# EasyEDA Pro project STM32F429BIT6 IGT6外围.epro, schematic SCH

## Sheets
1 MCU: Page Name: MCU; Project Name: 合泰杯; Schematic Name: 合泰; Update Date: 2023-08-08; Add into BOM: yes; Company: Your Company; Convert to PCB: yes; Date: 2023-06-11; Draw By: JustQin; REV: 1.0; Sheet: 1/1
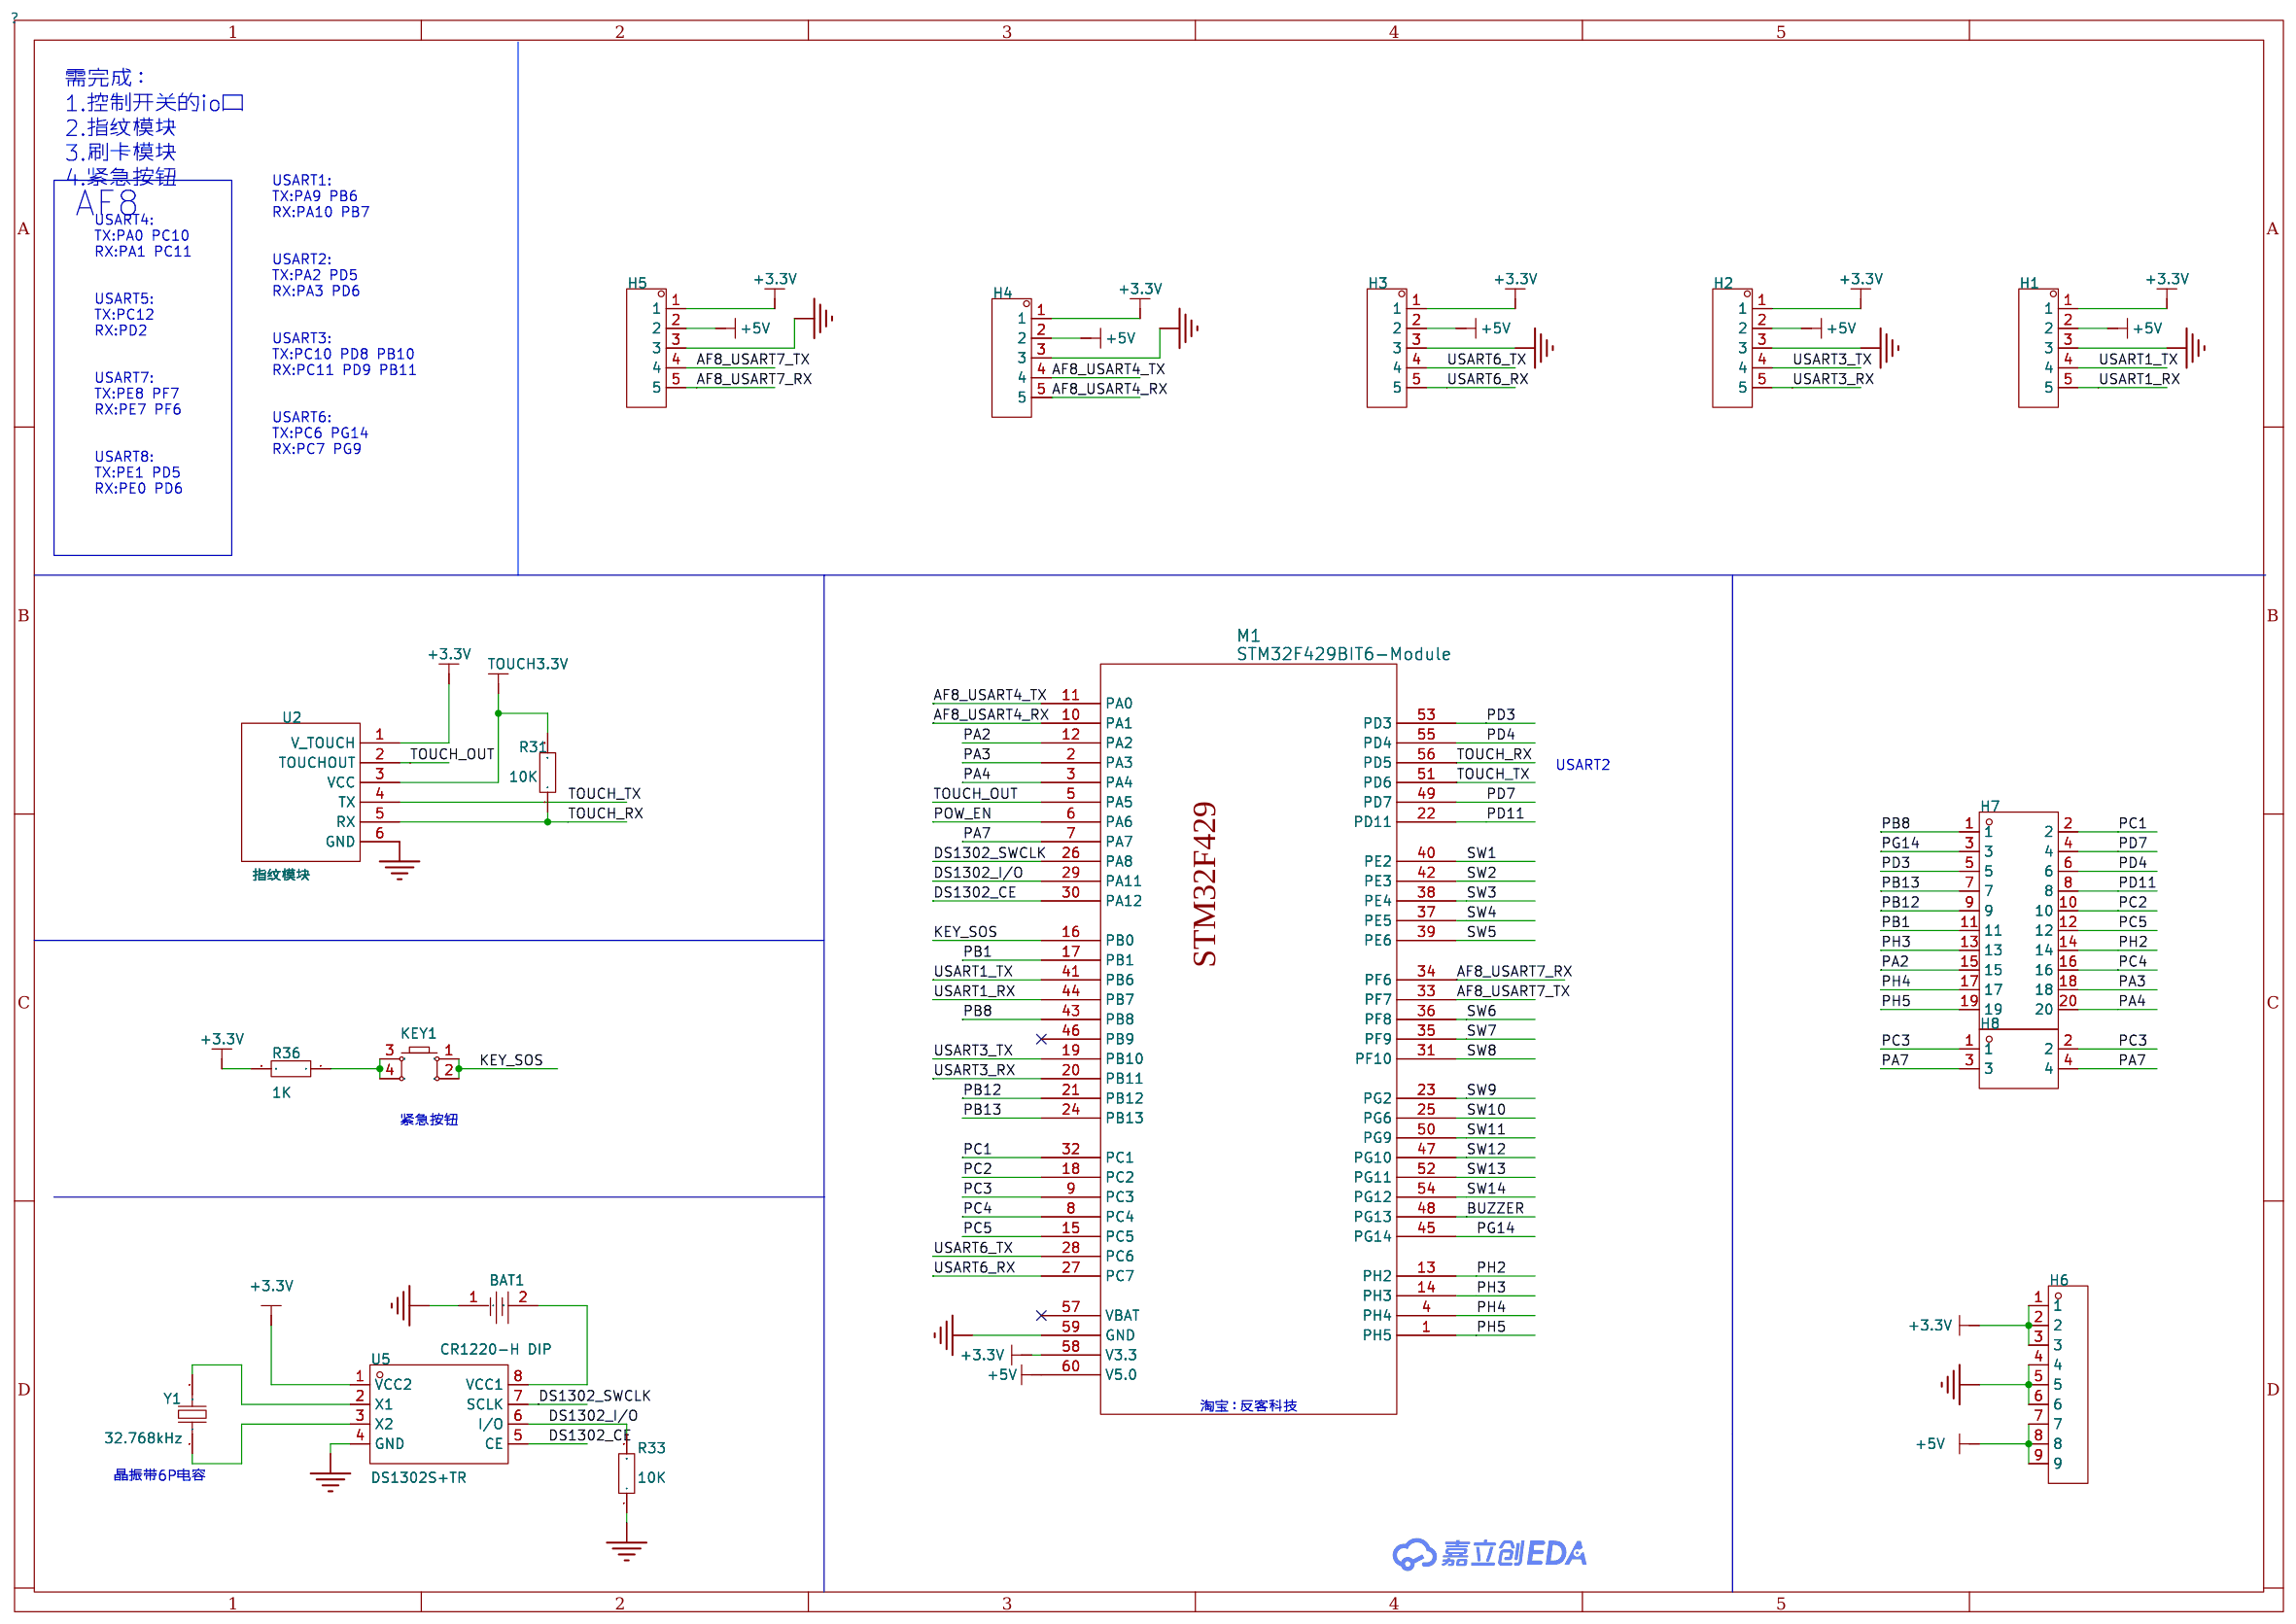
[diagram p0: MCU]
2 开关: Create Date: 2023-06-13; Page Name: 开关; Update Date: 2023-07-17; Company: 嘉立创EDA; Page Size: A4; Version: V1.0
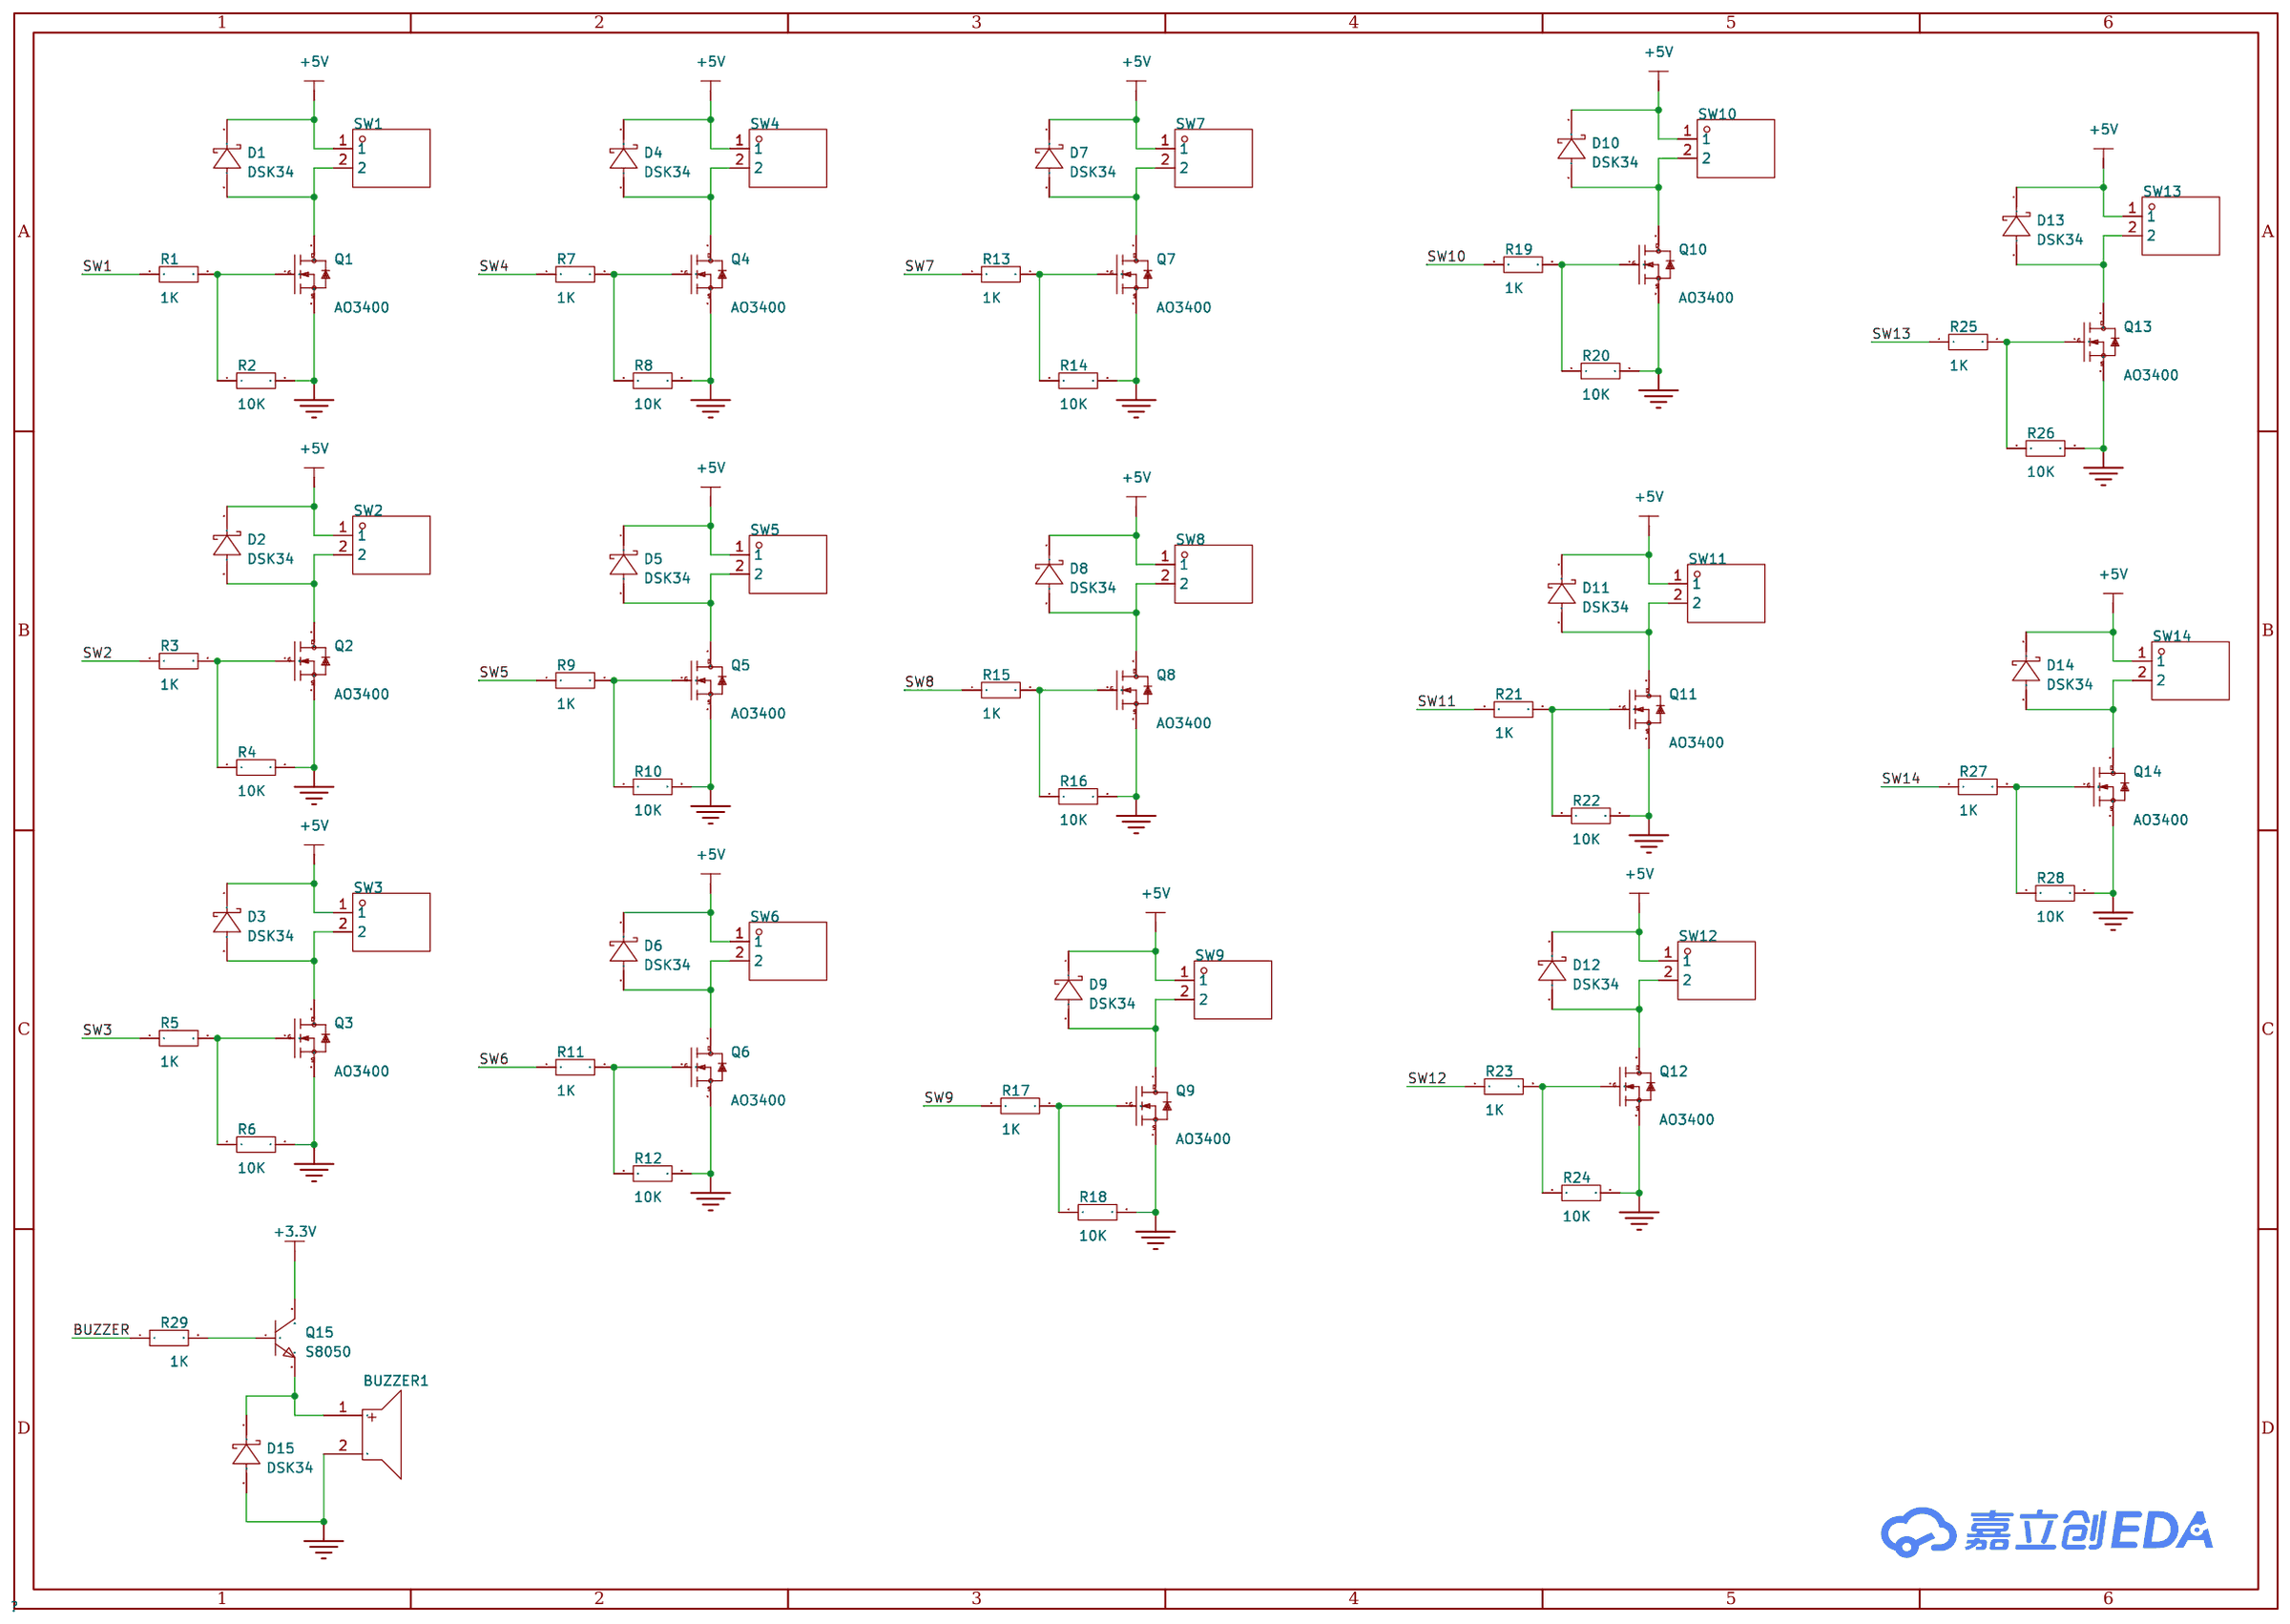
[diagram p1: 开关]
3 Power: Create Date: 2023-06-15; Page Name: Power; Company: 嘉立创EDA; Page Size: A4; Version: V1.0
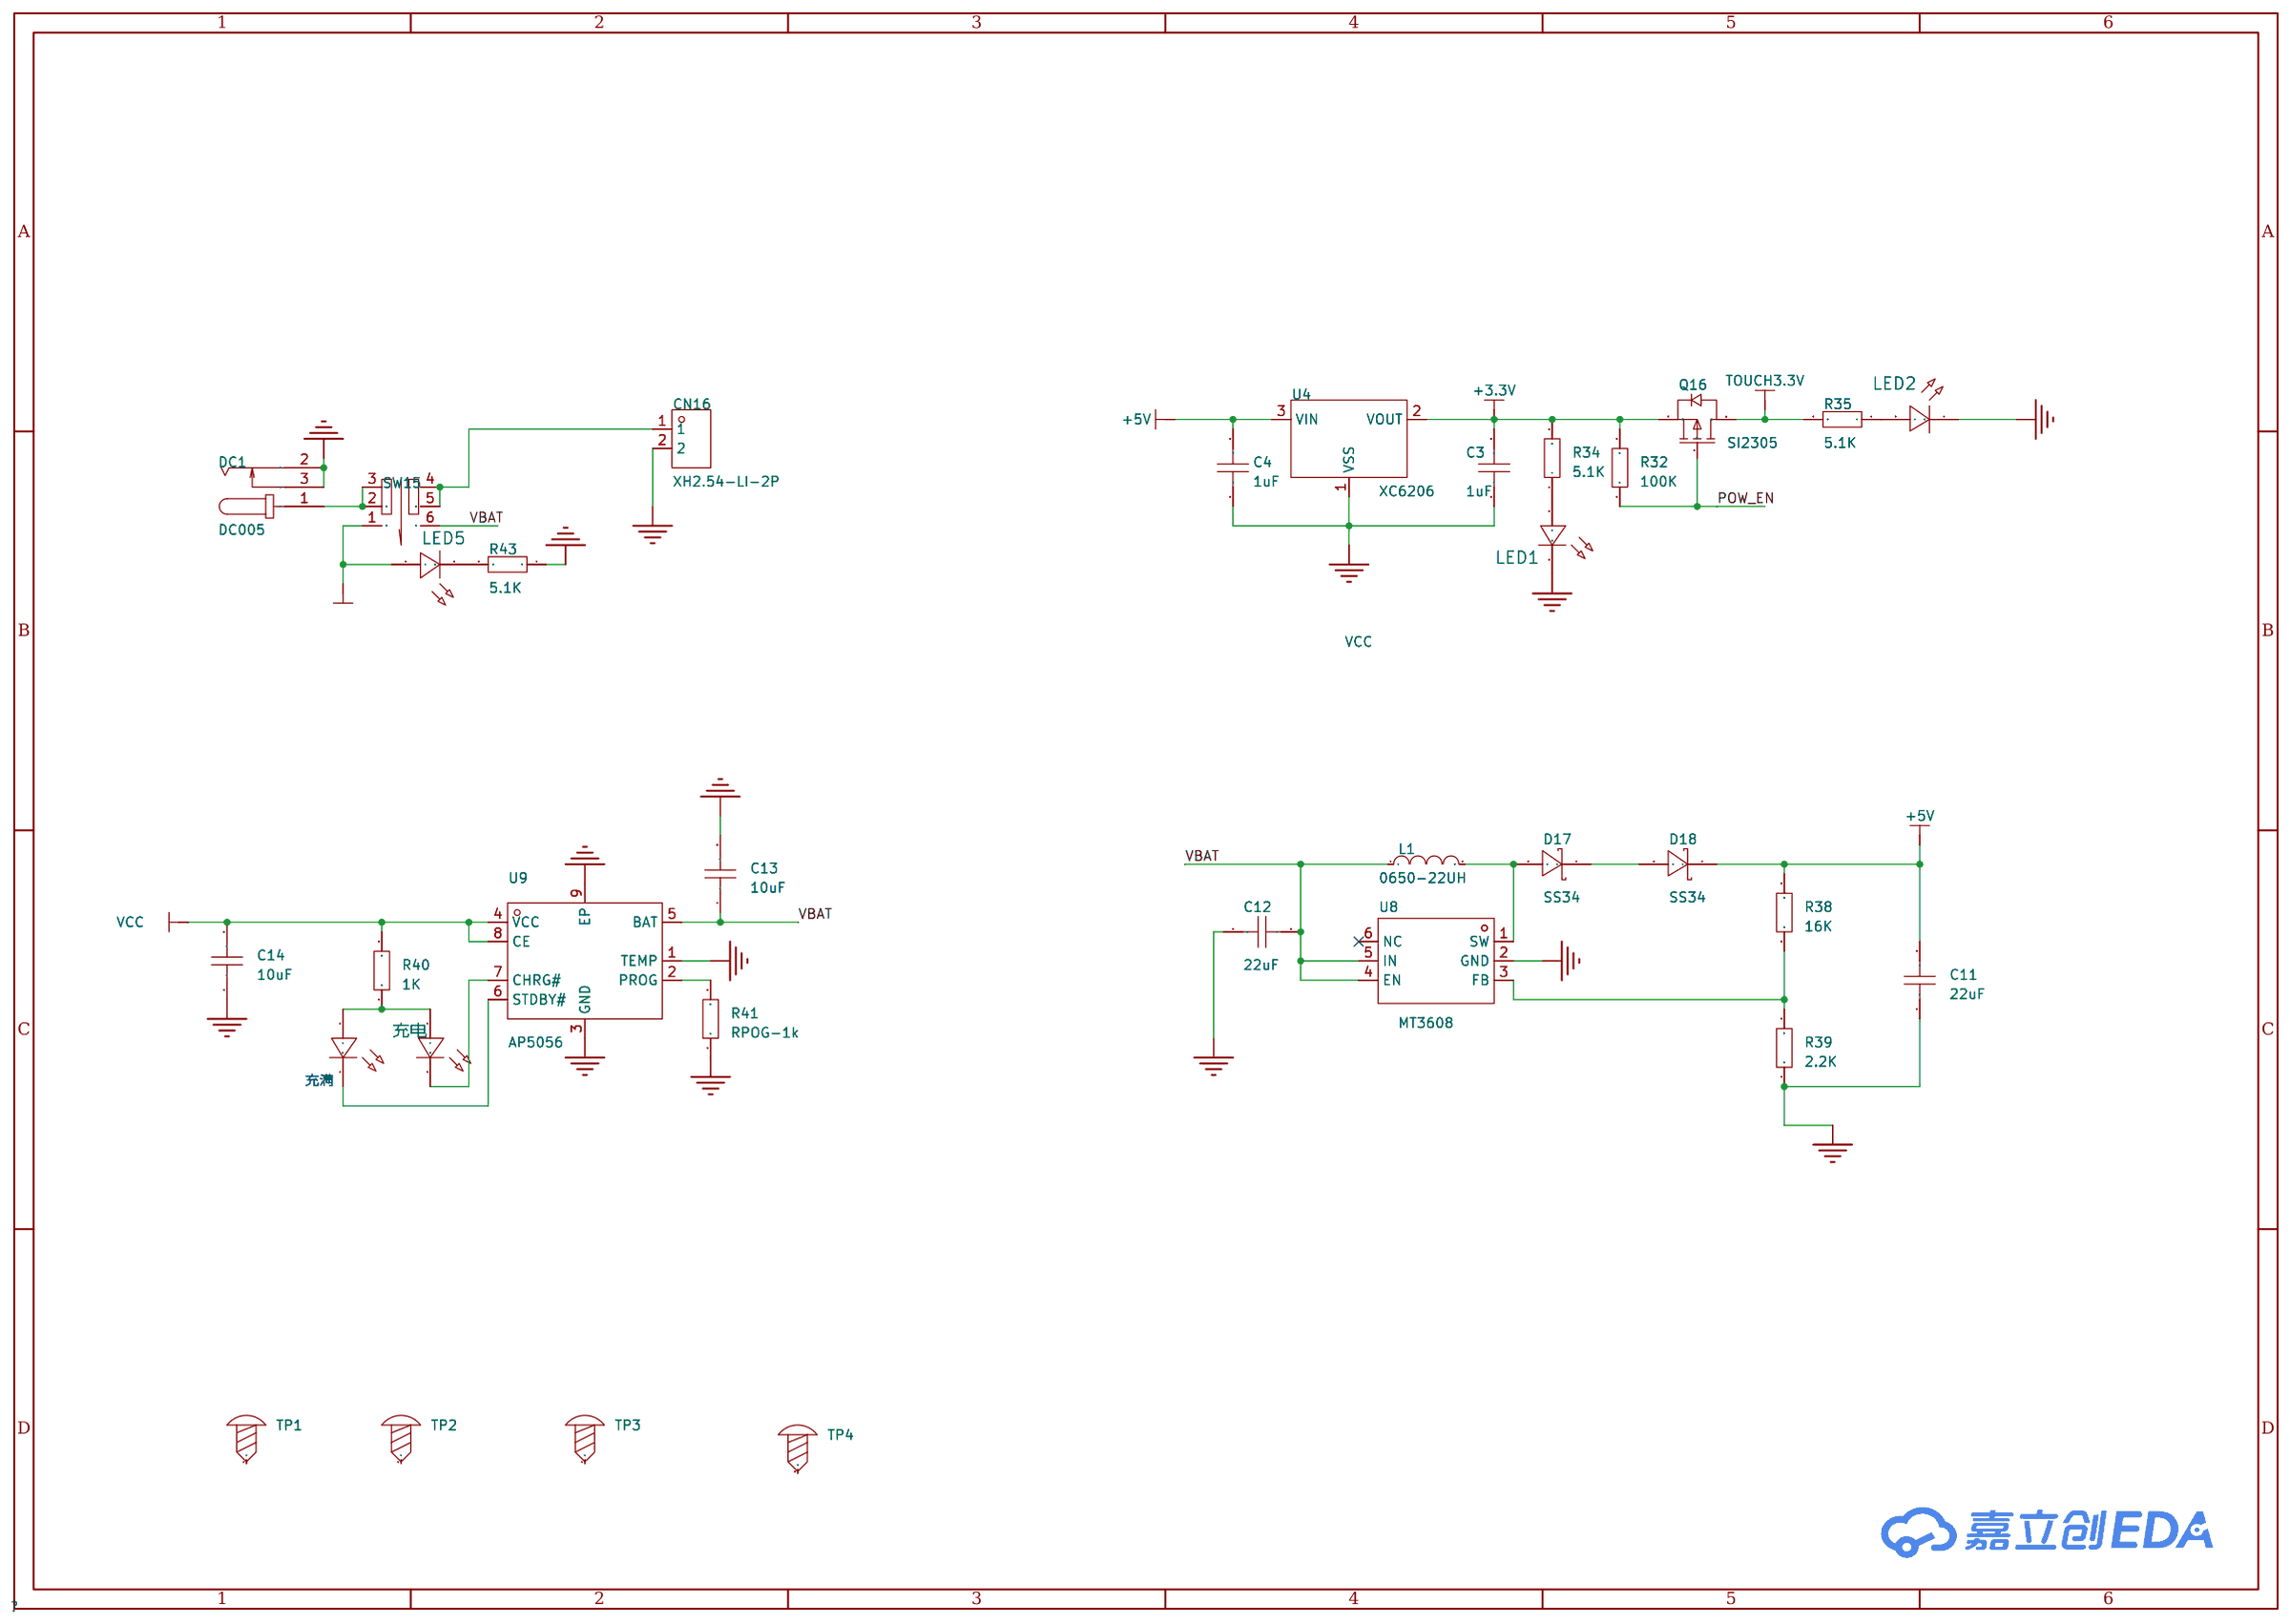
[diagram p2: Power]

## Parts
sheet MCU
BAT1  CR1220-H DIP  [BAT-TH_CR1220-H-DIP]
H1  -  [HDR-TH_5P-P2.54-V-M]
H2  -  [HDR-TH_5P-P2.54-V-M]
H3  -  [HDR-TH_5P-P2.54-V-M]
H4  -  [HDR-TH_5P-P2.54-V-M]
H5  -  [HDR-TH_5P-P2.54-V-M]
H6  -  [HDR-TH_9P-P2.54-V-M]
H7  -  [HDR-TH_20P-P2.54-V-M-R2-C10-S2.54]
H8  -  [HDR-TH_4P-P2.54-V-M-R2-C2-S2.54-1]
KEY1  -  [SW-SMD_4P-L6.0-W6.0-P4.50-LS9.0-2]
M1  STM32F429BIT6-Module  [STM32F429BI_CORE]
R31  10K  [R0603]
R33  10K  [R0603]
R36  1K  [R0603]
U2  指纹模块  [CONN-SMD_A1002WV-S-6P]
U5  DS1302S+TR  [SOP-8_L5.3-W5.3-P1.27-LS8.0-BL]
Y1  32.768kHz  [FC-135R_L3.2-W1.5]
sheet Power
C3  1uF  [C0603]
C4  1uF  [C0603]
C11  22uF  [C0603]
C12  22uF  [C0603]
C13  10uF  [C0603]
C14  10uF  [C0603]
CN16  XH2.54-LI-2P  [CONN-TH_2P-P2.54_HDR2]
D17  SS34  [DO-214AC_L4.3-W2.7-LS5.2-RD]
D18  SS34  [DO-214AC_L4.3-W2.7-LS5.2-RD]
DC1  DC005  [DC-IN-TH_DC005]
L1  0650-22UH  [IND-SMD_L7.8-W7.0_MAPM0630F]
LED1  -  [LED_0603]
LED2  -  [LED_0603]
LED5  -  [LED_0603]
Q16  SI2305  [SOT-23-3_L2.9-W1.6-P1.90-LS2.8-BR]
R32  100K  [R0603]
R34  5.1K  [R0603]
R35  5.1K  [R0603]
R38  16K  [R0603]
R39  2.2K  [R0603]
R40  1K  [R0603]
R41  RPOG-1k  [R0603]
R43  5.1K  [R0603]
SW15  自锁开关 5.8Z白灰白260G  [SW-TH_6P-L5.8-W5.8-P2.00-LS4.5-TR]
TP1  -  [M4螺丝]
TP2  -  [M4螺丝]
TP3  -  [M4螺丝]
TP4  -  [M4螺丝]
U4  XC6206  [SOT-23-3_L2.9-W1.3-P1.90-LS2.4-BR]
U8  MT3608  [SOT-23-6_L2.9-W1.6-P0.95-LS2.8-BL]
U9  AP5056  [SOP-8_L4.9-W3.9-P1.27-LS6.0-BL-EP]
充满  -  [LED_0603]
充电  -  [LED_0603]
sheet 开关
BUZZER1  2800Hz  [BUZ-TH_BD9.0-P5.00-D0.6-FD]
D1  DSK34  [SOD-123FL_L2.7-W1.8-LS3.8-RD]
D2  DSK34  [SOD-123FL_L2.7-W1.8-LS3.8-RD]
D3  DSK34  [SOD-123FL_L2.7-W1.8-LS3.8-RD]
D4  DSK34  [SOD-123FL_L2.7-W1.8-LS3.8-RD]
D5  DSK34  [SOD-123FL_L2.7-W1.8-LS3.8-RD]
D6  DSK34  [SOD-123FL_L2.7-W1.8-LS3.8-RD]
D7  DSK34  [SOD-123FL_L2.7-W1.8-LS3.8-RD]
D8  DSK34  [SOD-123FL_L2.7-W1.8-LS3.8-RD]
D9  DSK34  [SOD-123FL_L2.7-W1.8-LS3.8-RD]
D10  DSK34  [SOD-123FL_L2.7-W1.8-LS3.8-RD]
D11  DSK34  [SOD-123FL_L2.7-W1.8-LS3.8-RD]
D12  DSK34  [SOD-123FL_L2.7-W1.8-LS3.8-RD]
D13  DSK34  [SOD-123FL_L2.7-W1.8-LS3.8-RD]
D14  DSK34  [SOD-123FL_L2.7-W1.8-LS3.8-RD]
D15  DSK34  [SOD-123FL_L2.7-W1.8-LS3.8-RD]
Q1  AO3400  [SOT-23-3_L2.9-W1.3-P1.90-LS2.4-BR]
Q2  AO3400  [SOT-23-3_L2.9-W1.3-P1.90-LS2.4-BR]
Q3  AO3400  [SOT-23-3_L2.9-W1.3-P1.90-LS2.4-BR]
Q4  AO3400  [SOT-23-3_L2.9-W1.3-P1.90-LS2.4-BR]
Q5  AO3400  [SOT-23-3_L2.9-W1.3-P1.90-LS2.4-BR]
Q6  AO3400  [SOT-23-3_L2.9-W1.3-P1.90-LS2.4-BR]
Q7  AO3400  [SOT-23-3_L2.9-W1.3-P1.90-LS2.4-BR]
Q8  AO3400  [SOT-23-3_L2.9-W1.3-P1.90-LS2.4-BR]
Q9  AO3400  [SOT-23-3_L2.9-W1.3-P1.90-LS2.4-BR]
Q10  AO3400  [SOT-23-3_L2.9-W1.3-P1.90-LS2.4-BR]
Q11  AO3400  [SOT-23-3_L2.9-W1.3-P1.90-LS2.4-BR]
Q12  AO3400  [SOT-23-3_L2.9-W1.3-P1.90-LS2.4-BR]
Q13  AO3400  [SOT-23-3_L2.9-W1.3-P1.90-LS2.4-BR]
Q14  AO3400  [SOT-23-3_L2.9-W1.3-P1.90-LS2.4-BR]
Q15  S8050  [SOT-23-3_L2.9-W1.6-P1.90-LS2.8-BR]
R1  1K  [R0603]
R2  10K  [R0603]
R3  1K  [R0603]
R4  10K  [R0603]
R5  1K  [R0603]
R6  10K  [R0603]
R7  1K  [R0603]
R8  10K  [R0603]
R9  1K  [R0603]
R10  10K  [R0603]
R11  1K  [R0603]
R12  10K  [R0603]
R13  1K  [R0603]
R14  10K  [R0603]
R15  1K  [R0603]
R16  10K  [R0603]
R17  1K  [R0603]
R18  10K  [R0603]
R19  1K  [R0603]
R20  10K  [R0603]
R21  1K  [R0603]
R22  10K  [R0603]
R23  1K  [R0603]
R24  10K  [R0603]
R25  1K  [R0603]
R26  10K  [R0603]
R27  1K  [R0603]
R28  10K  [R0603]
R29  1K  [R0603]
SW1  B2B-XH-A(LF)(SN)  [CONN-TH_B2B-XH-A-LF-SN]
SW2  B2B-XH-A(LF)(SN)  [CONN-TH_B2B-XH-A-LF-SN]
SW3  B2B-XH-A(LF)(SN)  [CONN-TH_B2B-XH-A-LF-SN]
SW4  B2B-XH-A(LF)(SN)  [CONN-TH_B2B-XH-A-LF-SN]
SW5  B2B-XH-A(LF)(SN)  [CONN-TH_B2B-XH-A-LF-SN]
SW6  B2B-XH-A(LF)(SN)  [CONN-TH_B2B-XH-A-LF-SN]
SW7  B2B-XH-A(LF)(SN)  [CONN-TH_B2B-XH-A-LF-SN]
SW8  B2B-XH-A(LF)(SN)  [CONN-TH_B2B-XH-A-LF-SN]
SW9  B2B-XH-A(LF)(SN)  [CONN-TH_B2B-XH-A-LF-SN]
SW10  B2B-XH-A(LF)(SN)  [CONN-TH_B2B-XH-A-LF-SN]
SW11  B2B-XH-A(LF)(SN)  [CONN-TH_B2B-XH-A-LF-SN]
SW12  B2B-XH-A(LF)(SN)  [CONN-TH_B2B-XH-A-LF-SN]
SW13  B2B-XH-A(LF)(SN)  [CONN-TH_B2B-XH-A-LF-SN]
SW14  B2B-XH-A(LF)(SN)  [CONN-TH_B2B-XH-A-LF-SN]

## Library data of the parts
BAT1 = CR1220-H DIP: 插件,φ12.6x2.2mm; LCSC Part Name: FLYOUNG(远阳) 纽扣电池CR1220 3V 卧式焊脚 CR1220-H DIP; Supplier Part: C5154873; Manufacturer: FLYOUNG(远阳); JLCPCB Part Class: Extended Part; Datasheet: https://atta.szlcsc.com/upload/public/pdf/source/20230316/B36AFCD2634B313A32389D3C0D8C701B.pdf; Supplier: LCSC
H1-H5 = HDR-M_2.54_1x5P: Supplier Part: C358687; Supplier Footprint: 插件
H6 = HDR-M_2.54-1x9P: Supplier Part: C492408; Supplier Footprint: 插件
H7 = HDR-M_2.54_2x10: Supplier Part: C30734; Supplier Footprint: 插件,P=2.54mm
H8 = HDR-M_2.54_2x2: Supplier Part: C160338; Supplier Footprint: 插件,P=2.54mm
KEY1 = Key_SMD_6x6x6.5: Supplier Footprint: SMD
M1 = STM32F429BIT6-Module
R1-R29 R31-R36 R38-R41 R43 = Res_0603: Supplier Footprint: 0603
U2 = HLK-FPM383C: JLCPCB Part Class: 扩展库
U5 = DS1302S+T&R: Supplier Part: C880673; Manufacturer: MAXIM(美信); Supplier Footprint: SO-8; JLCPCB Part Class: Extended Part; Datasheet: https://atta.szlcsc.com/upload/public/pdf/source/20201223/C880673_7692D9A17A3D1BB2F2A52002F2E3DE01.pdf; Supplier: LCSC
Y1 = Q13FC1350000400: 频率:32.768kHz;频率公差:±20ppm;负载电容:12.5pF;; LCSC Part Name: 32.768kHz ±20ppm 12.5pF; Supplier Part: C32346; Manufacturer: EPSON(爱普生); Supplier Footprint: SMD3215-2P; JLCPCB Part Class: Basic Part; Datasheet: https://atta.szlcsc.com/upload/public/pdf/source/20190108/C32346_746D6B07EAF90824457A96480007685F.pdf; Supplier: LCSC; Crystal Type: 贴片无源晶振; Frequency Tolerance: ±20ppm; Load Capacitance: 12.5pF; Equivalent Series Resistance (ESR): 70kΩ; Operating Temperature: -40℃~+85℃
C3 C4 C11-C14 = CAP_0603: Supplier Footprint: 0603
CN16 = XH2.54-LI-2P: Supplier Part: C9900023170; Supplier Footprint: CONN-TH_2[; JLCPCB Part Class: Extended Part; Supplier: LCSC
D17 D18 = SS34_C8678: 二极管配置:独立式;直流反向耐压(Vr):40V;平均整流电流(Io):3A;正向压降(Vf):550mV@3A;; LCSC Part Name: 40V 3A 550mV@3A; Supplier Part: C8678; Manufacturer: MDD; Supplier Footprint: SMA(DO-214AC); JLCPCB Part Class: Basic Part; Datasheet: https://atta.szlcsc.com/upload/public/pdf/source/20230314/A80AE34493C69B89E2F4B1712F433538.pdf; Supplier: LCSC; Diode Configuration: 独立式; Reverse Voltage (Vr): 40V; Average Rectified Current (Io): 3A; Forward Voltage (Vf@If): 550mV@3A; Reverse Leakage Current (Ir): 500uA@40V
DC1 = DC005: 连接器类型:DC电源插座;安装方式:弯插;触点内径:2mm;触点外径:6.3mm;额定电流:500mA;额定电压:30V;工作温度范围:-40℃~+55℃;; LCSC Part Name: DC电源插座 内径:2mm 外径:6.3mm 铁材质; Supplier Part: C431533; Manufacturer: SHOU HAN(首韩); Supplier Footprint: 插件; JLCPCB Part Class: Extended Part; Datasheet: https://atta.szlcsc.com/upload/public/pdf/source/20190925/C431533_4751811035784AC1D38EBC85F7905E99.pdf; Supplier: LCSC; Connector Type: DC电源插座; Mounting Style: 弯插; Inside Contact Diameter: 2mm; Outside Contact Diameter: 6.3mm; Current Rating (Max): 500mA; Voltage Rating (Max): 30V; Operating Temperature Range: -40℃~+55℃
L1 = 0650-2.2UH: Supplier Part: C9900012394; Supplier Footprint: SMD_0650; JLCPCB Part Class: Extended Part; Datasheet: https://atta.szlcsc.comnull; Supplier: LCSC
LED1 LED2 LED5 充电 = LED_0603-R: Supplier Footprint: 0603
Q16 = SI2305_C382302: 类型:P沟道;漏源电压(Vdss):20V;连续漏极电流(Id):4.2A;功率(Pd):1.38W;导通电阻(RDS(on)@Vgs,Id):65mΩ@4.5V,4.2A;阈值电压(Vgs(th)@Id):500mV@250uA;; LCSC Part Name: P沟道 20V 4.2A; Supplier Part: C382302; Manufacturer: KEXIN(科信); Supplier Footprint: SOT-23; JLCPCB Part Class: Extended Part; Datasheet: https://atta.szlcsc.com/upload/public/pdf/source/20190710/C382302_C5AD358ABF6A9CE4DBEEB24A63E5B0AD.pdf; Supplier: LCSC; Type: P沟道; Drain Source Voltage (Vdss): 20V; Continuous Drain Current (Id): 4.2A; Power Dissipation (Pd): 1.38W; Drain Source On Resistance (RDS(on)@Vgs,Id): 65mΩ@4.5V,4.2A; Gate Threshold Voltage (Vgs(th)@Id): 500mV@250uA
SW15 = 自锁开关 5.8Z白灰白260G: 耐温260度; LCSC Part Name: 自锁开关 5.8Z白灰白 260G  5.8*5.8mm; Supplier Part: C56857; Supplier Footprint: Through Hole; JLCPCB Part Class: Extended Part; Datasheet: https://atta.szlcsc.com/upload/public/pdf/source/20160318/1458266987096.pdf; Supplier: LCSC
TP1-TP4 = M4螺丝: Supplier Footprint: 插件
U4 = XC6206P332MR_C5148692: 输出类型:固定;输出极性:正;最大输入电压:8V;输出电压:3.3V;输出电流:300mA;; LCSC Part Name: XC6206P332MR; Supplier Part: C5148692; Manufacturer: HXY MOSFET(华轩阳电子); Supplier Footprint: SOT-23; JLCPCB Part Class: Extended Part; Datasheet: https://atta.szlcsc.com/upload/public/pdf/source/20230315/7D5B35EFFBBF81C2EFC36318D2A1A670.pdf; Supplier: LCSC; Output Type: 固定; Output Polarity: 正; Number of Outputs: 1; Maximum Input Voltage: 8V; Output Voltage: 3.3V; Dropout Voltage: 240mV@(50mA); Output Current: 300mA
U8 = MT3608: 功能类型:升压型;输入电压:2V~24V;输出电压:28V;输出电流(最大值):-;; LCSC Part Name: 升压型 输入2V~24V 输出28V; Supplier Part: C84817; Manufacturer: 西安航天民芯; Supplier Footprint: SOT-23-6; JLCPCB Part Class: Extended Part; Datasheet: https://atta.szlcsc.com/upload/public/pdf/source/20161110/1478743351706.pdf; Supplier: LCSC; Function: 升压型; Number of Outputs: 1; Topology: 升压式; Input Voltage: 2V~24V; Output Voltage: 28V; Switching Frequency: 1.2MHz
U9 = AP5056: 常用锂电池充电芯片，功能同TP4056; Supplier Part: C81910; Manufacturer: chipown(芯朋微电子); Supplier Footprint: SOP-8-EP; JLCPCB Part Class: Extended Part; Datasheet: https://atta.szlcsc.com/upload/public/pdf/source/20170918/C81910_1505700200349975039.pdf; Supplier: LCSC
充满 = LED_0603-G: Supplier Footprint: 0603
BUZZER1 = YX-YT9042 3v: 驱动方式:有源(内含驱动线路);构造类型:电磁式;额定电压:3V;工作电压:2V~4V;消耗电流:30mA;频率:2800Hz;声压(SPL):80dB@10cm;直径(φD):9mm;长度:-;宽度:-;高度:4.2mm;工作温度:-20℃~+70℃;; LCSC Part Name: 有源电磁式蜂鸣器; Supplier Part: C781847; Manufacturer: YUEXIN(悦馨); Supplier Footprint: 插件; JLCPCB Part Class: Extended Part; Datasheet: https://atta.szlcsc.com/upload/public/pdf/source/20200925/C781847_A50BA0C189E3E52F6E474989C5FCC3AC.pdf; Supplier: LCSC; Oscillator Circuit: 有源(内含驱动线路); Technology Type: 电磁式; Rated Voltage: 3V; Operating Voltage: 2V~4V; Current Consumption: 30mA; Sound Pressure Level (SPL): 80dB@10cm; Diameter (φD): 9mm; Height: 4.2mm; Operating Temperature: -20℃~+70℃
D1-D15 = DSK34_C727076: Supplier Part: C727076; Manufacturer: TWGMC(台湾迪嘉); Supplier Footprint: SOD-123FL; JLCPCB Part Class: Extended Part; Datasheet: https://atta.szlcsc.com/upload/public/pdf/source/20200828/C727076_B37FCA1E25E95F22A97D5A5D18D72E25.pdf; Supplier: LCSC
Q1-Q14 = AO3400_C181090: 类型:N沟道;漏源电压(Vdss):30V;连续漏极电流(Id):5.8A;功率(Pd):350mW;导通电阻(RDS(on)@Vgs,Id):35mΩ@10V,5.8A;阈值电压(Vgs(th)@Id):1.4V@250uA;; LCSC Part Name: N沟道 30V 5.8A; Supplier Part: C181090; Manufacturer: Hottech(合科泰); Supplier Footprint: SOT-23; JLCPCB Part Class: Extended Part; Datasheet: https://atta.szlcsc.com/upload/public/pdf/source/20220427/6A3871894567E8883DB64081D5FF8011.pdf; Supplier: LCSC; Type: N沟道; Drain Source Voltage (Vdss): 30V; Continuous Drain Current (Id): 5.8A; Power Dissipation (Pd): 350mW; Drain Source On Resistance (RDS(on)@Vgs,Id): 35mΩ@10V,5.8A; Gate Threshold Voltage (Vgs(th)@Id): 1.4V@250uA
Q15 = S8050_C105433: 晶体管类型:NPN;集射极击穿电压(Vceo):25V;集电极电流(Ic):500mA;功率(Pd):300mW;直流电流增益(hFE@Ic,Vce):120@50mA,1V;; LCSC Part Name: NPN 25V 500mA L档 120-200; Supplier Part: C105433; Manufacturer: CJ(江苏长电/长晶); Supplier Footprint: SOT-23; JLCPCB Part Class: Extended Part; Datasheet: https://atta.szlcsc.com/upload/public/pdf/source/20170415/1492237762328.pdf; Supplier: LCSC; Transistor Type: NPN; Collector-Emitter Breakdown Voltage (Vceo): 25V; Collector Current (Ic): 500mA; Power Dissipation (Pd): 300mW; Collector Cut-Off Current (Icbo): 100nA; Collector-Emitter Saturation Voltage (VCE(sat)@Ic,Ib): 600mV@500mA,50mA; DC Current Gain (hFE@Ic,Vce): 120@50mA,1V; Transition Frequency (fT): 150MHz; Operating Temperature: +150℃@(Tj)
SW1-SW14 = B2B-XH-A(LF)(SN): 参考系列:XH;间距:2.5mm;插针结构:1x2P;排数:1;每排PIN数:2;行距:-;安装方式:-;触头材质:黄铜;; LCSC Part Name: XH 2.5mm 1x2P; Supplier Part: C158012; Manufacturer: JST; Supplier Footprint: 插件,P=2.5mm; JLCPCB Part Class: Extended Part; Datasheet: https://atta.szlcsc.com/upload/public/pdf/source/20180319/9D0AC2122F92891443E3C996983D6D0E.pdf; Supplier: LCSC; Reference Series: XH; Pitch: 2.5mm; Pins Structure: 1x2P; Number of Rows: 1; Number of PINs Per Row: 2; Contact Material: 黄铜

## Nets
+3.3V: C3.2 H1.1 H2.1 H3.1 H4.1 H5.1 H6.1 H6.2 H6.3 M1.58(V3.3) Q15.3 Q16.2(S) R32.2 R34.2 R36.2 U2.1(V_TOUCH) U4.2(VOUT) U5.1(VCC2)
+5V: C4.2 C11.2 D1.1(K) D2.1(K) D3.1(K) D4.1(K) D5.1(K) D6.1(K) D7.1(K) D8.1(K) D9.1(K) D10.1(K) D11.1(K) D12.1(K) D13.1(K) D14.1(K) D18.1(K) H1.2 H2.2 H3.2 H4.2 H5.2 H6.7 H6.8 H6.9 M1.60(V5.0) R38.2 SW1.1 SW2.1 SW3.1 SW4.1 SW5.1 SW6.1 SW7.1 SW8.1 SW9.1 SW10.1 SW11.1 SW12.1 SW13.1 SW14.1 U4.3(VIN)
GND: BAT1.1 BUZZER1.2 C3.1 C4.1 C11.1 C12.2 C13.2 C14.1 CN16.2 D15.2(A) DC1.2 DC1.3 H1.3 H2.3 H3.3 H4.3 H5.3 H6.4 H6.5 H6.6 LED1.1(C) LED2.1(C) M1.59(GND) Q1.2(S) Q2.2(S) Q3.2(S) Q4.2(S) Q5.2(S) Q6.2(S) Q7.2(S) Q8.2(S) Q9.2(S) Q10.2(S) Q11.2(S) Q12.2(S) Q13.2(S) Q14.2(S) R2.2 R4.2 R6.2 R8.2 R10.2 R12.2 R14.2 R16.2 R18.2 R20.2 R22.2 R24.2 R26.2 R28.2 R33.1 R39.1 R41.1 R43.1 U2.6(GND) U4.1(VSS) U5.4(GND) U8.2(GND) U9.1(TEMP) U9.3(GND) U9.9(EP)
VBAT: C12.1 C13.1 L1.1 SW15.6 U8.4(EN) U8.5(IN) U9.5(BAT)
VCC: C14.2 LED5.2(A) R40.2 SW15.1 U9.4(VCC) U9.8(CE)
AF8_USART4_RX: H4.5 M1.10(PA1)
AF8_USART4_TX: H4.4 M1.11(PA0)
AF8_USART7_RX: H5.5 M1.34(PF6)
AF8_USART7_TX: H5.4 M1.33(PF7)
BUZZER: M1.48(PG13) R29.1
DS1302_CE: M1.30(PA12) U5.5(CE)
DS1302_I/O: M1.29(PA11) R33.2 U5.6(I/O)
DS1302_SWCLK: M1.26(PA8) U5.7(SCLK)
KEY_SOS: KEY1.1 KEY1.2 M1.16(PB0)
PA2: H7.15 M1.12(PA2)
PA3: H7.18 M1.2(PA3)
PA4: H7.20 M1.3(PA4)
PA7: H8.3 H8.4 M1.7(PA7)
PB1: H7.11 M1.17(PB1)
PB8: H7.1 M1.43(PB8)
PB12: H7.9 M1.21(PB12)
PB13: H7.7 M1.24(PB13)
PC1: H7.2 M1.32(PC1)
PC2: H7.10 M1.18(PC2)
PC3: H8.1 H8.2 M1.9(PC3)
PC4: H7.16 M1.8(PC4)
PC5: H7.12 M1.15(PC5)
PD3: H7.5 M1.53(PD3)
PD4: H7.6 M1.55(PD4)
PD7: H7.4 M1.49(PD7)
PD11: H7.8 M1.22(PD11)
PG14: H7.3 M1.45(PG14)
PH2: H7.14 M1.13(PH2)
PH3: H7.13 M1.14(PH3)
PH4: H7.17 M1.4(PH4)
PH5: H7.19 M1.1(PH5)
POW_EN: M1.6(PA6) Q16.1(G) R32.1
SW1: M1.40(PE2) R1.1
SW2: M1.42(PE3) R3.1
SW3: M1.38(PE4) R5.1
SW4: M1.37(PE5) R7.1
SW5: M1.39(PE6) R9.1
SW6: M1.36(PF8) R11.1
SW7: M1.35(PF9) R13.1
SW8: M1.31(PF10) R15.1
SW9: M1.23(PG2) R17.1
SW10: M1.25(PG6) R19.1
SW11: M1.50(PG9) R21.1
SW12: M1.47(PG10) R23.1
SW13: M1.52(PG11) R25.1
SW14: M1.54(PG12) R27.1
TOUCH3.3V: Q16.3(D) R31.2 R35.2 U2.3(VCC)
TOUCH_OUT: M1.5(PA5) U2.2(TOUCHOUT)
TOUCH_RX: M1.56(PD5) R31.1 U2.5(RX)
TOUCH_TX: M1.51(PD6) U2.4(TX)
USART1_RX: H1.5 M1.44(PB7)
USART1_TX: H1.4 M1.41(PB6)
USART3_RX: H2.5 M1.20(PB11)
USART3_TX: H2.4 M1.19(PB10)
USART6_RX: H3.5 M1.27(PC7)
USART6_TX: H3.4 M1.28(PC6)
$1N5077: BAT1.2 U5.8(VCC1)
$1N5205: U5.3(X2) Y1.1
$1N8903: KEY1.3 KEY1.4 R36.1
$1N11477: U5.2(X1) Y1.2
$2N2294: D1.2(A) Q1.3(D) SW1.2
$2N2302: Q1.1(G) R1.2 R2.1
$2N2313: D2.2(A) Q2.3(D) SW2.2
$2N2321: Q2.1(G) R3.2 R4.1
$2N2332: D3.2(A) Q3.3(D) SW3.2
$2N2340: Q3.1(G) R5.2 R6.1
$2N2351: D4.2(A) Q4.3(D) SW4.2
$2N2359: Q4.1(G) R7.2 R8.1
$2N2370: D5.2(A) Q5.3(D) SW5.2
$2N2378: Q5.1(G) R9.2 R10.1
$2N2389: D6.2(A) Q6.3(D) SW6.2
$2N2397: Q6.1(G) R11.2 R12.1
$2N2408: D7.2(A) Q7.3(D) SW7.2
$2N2416: Q7.1(G) R13.2 R14.1
$2N2427: D8.2(A) Q8.3(D) SW8.2
$2N2435: Q8.1(G) R15.2 R16.1
$2N2446: D9.2(A) Q9.3(D) SW9.2
$2N2454: Q9.1(G) R17.2 R18.1
$2N2465: D10.2(A) Q10.3(D) SW10.2
$2N2473: Q10.1(G) R19.2 R20.1
$2N2484: D11.2(A) Q11.3(D) SW11.2
$2N2492: Q11.1(G) R21.2 R22.1
$2N2503: D12.2(A) Q12.3(D) SW12.2
$2N2511: Q12.1(G) R23.2 R24.1
$2N2522: D13.2(A) Q13.3(D) SW13.2
$2N2530: Q13.1(G) R25.2 R26.1
$2N2541: D14.2(A) Q14.3(D) SW14.2
$2N2549: Q14.1(G) R27.2 R28.1
$2N2772: BUZZER1.1 D15.1(K) Q15.2
$2N2814: Q15.1 R29.2
$4N2282: LED1.2(A) R34.1
$4N2367: LED2.2(A) R35.1
$4N4057: DC1.1 SW15.2 SW15.3
$4N6170: D17.2(A) L1.2 U8.1(SW)
$4N6171: R38.1 R39.2 U8.3(FB)
$4N6187: R41.2 U9.2(PROG)
$4N7188: LED5.1(C) R43.2
$4N10438: CN16.1 SW15.4 SW15.5
$4N10482: D17.1(K) D18.2(A)
Net-(R40-1): R40.1 充满.2(A) 充电.2(A)
Net-(U9-6): U9.6(STDBY#) 充满.1(C)
Net-(U9-7): U9.7(CHRG#) 充电.1(C)

Not connected (* = marked no-connect by the designer): M1 46(PB9)* 57(VBAT)*; TP1 1; TP2 1; TP3 1; TP4 1; U8 6(NC)*

## Notes on the sheets
sheet 1
- 需完成：
  1.控制开关的io口
  2.指纹模块
  3.刷卡模块
  4.紧急按钮
- AF8
- USART1:
  TX:PA9 PB6
  RX:PA10 PB7
- USART4:
  TX:PA0 PC10
  RX:PA1 PC11
- USART2:
  TX:PA2 PD5
  RX:PA3 PD6
- USART5:
  TX:PC12
  RX:PD2
- USART3:
  TX:PC10 PD8 PB10
  RX:PC11 PD9 PB11
- USART7:
  TX:PE8 PF7
  RX:PE7 PF6
- USART6:
  TX:PC6 PG14
  RX:PC7 PG9
- USART8:
  TX:PE1 PD5
  RX:PE0 PD6
- USART2
- 紧急按钮
- 淘宝：反客科技
- 晶振带6P电容
